# EAGLE design DCMotorControl.v01 (EAGLE 7.4.0)
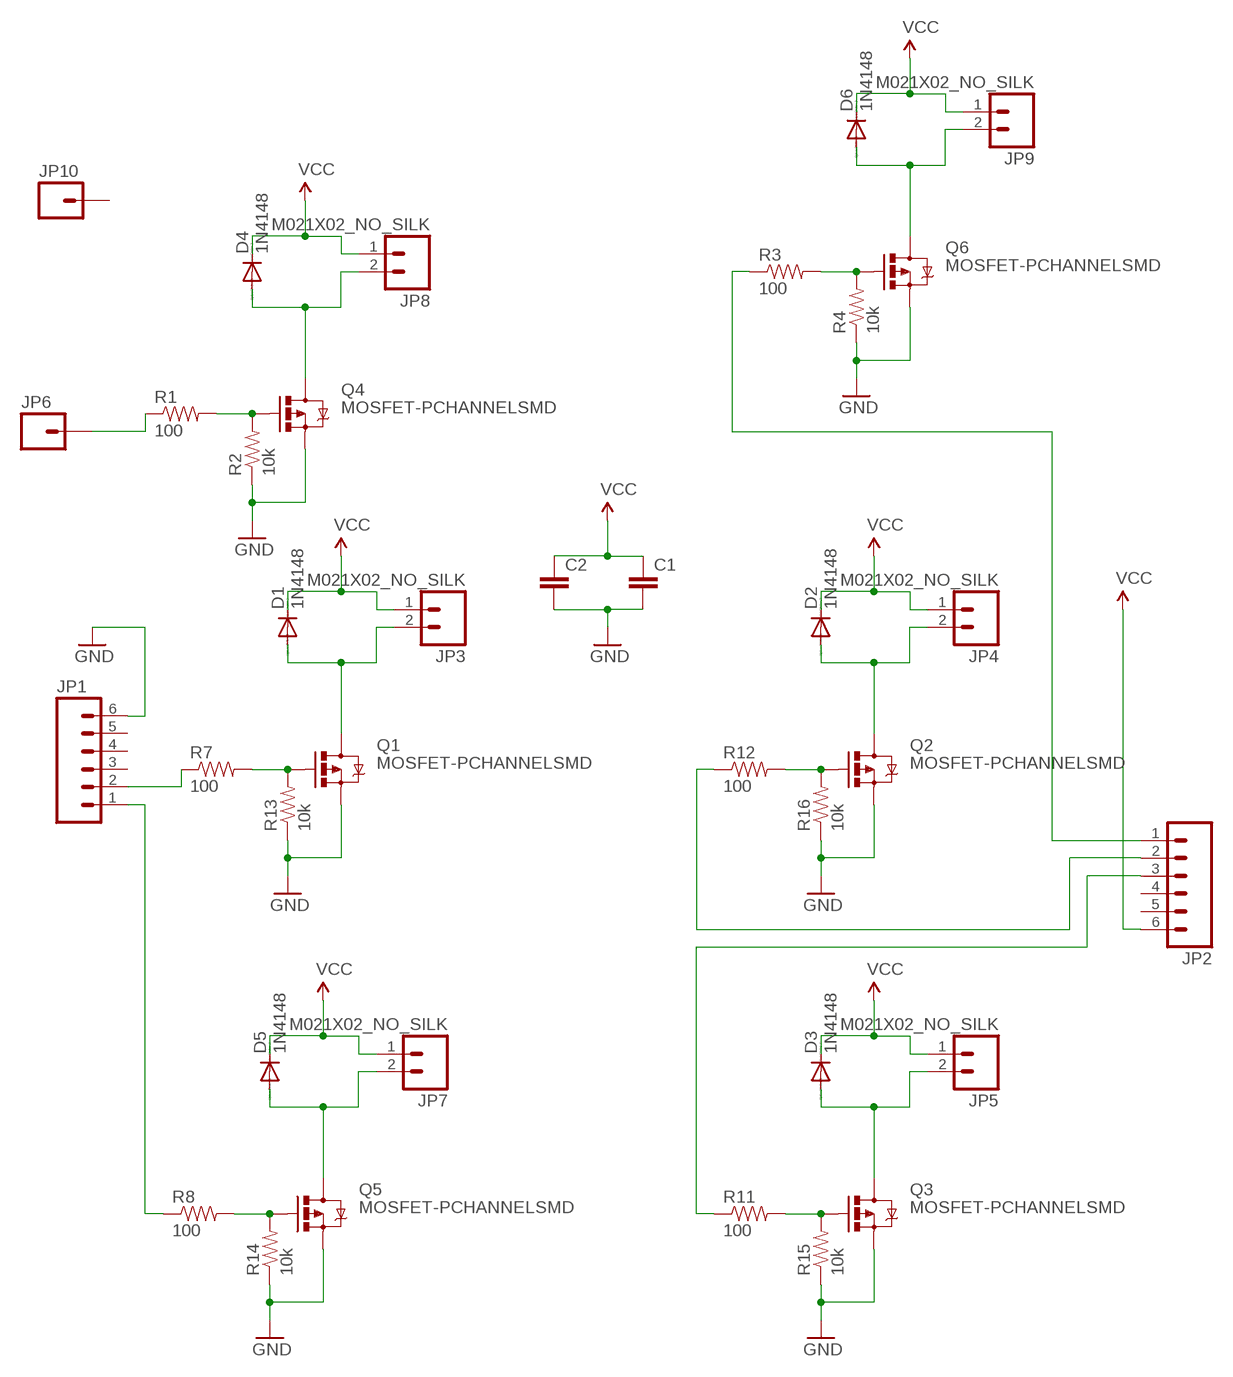
[diagram p0: schematic, sheet 1]

## Parts
C1  CAP0805  [0805]
C2  CAP0805  [0805]
D1  1N4148  DIODE-SOD323-R  [SOD323-R]
D2  1N4148  DIODE-SOD323-R  [SOD323-R]
D3  1N4148  DIODE-SOD323-R  [SOD323-R]
D4  1N4148  DIODE-SOD323-R  [SOD323-R]
D5  1N4148  DIODE-SOD323-R  [SOD323-R]
D6  1N4148  DIODE-SOD323-R  [SOD323-R]
JP1  M06NO_SILK  [1X06_NO_SILK]
JP2  M06NO_SILK  [1X06_NO_SILK]
JP3  M021X02_NO_SILK  [1X02_NO_SILK]
JP4  M021X02_NO_SILK  [1X02_NO_SILK]
JP5  M021X02_NO_SILK  [1X02_NO_SILK]
JP6  M01NOSILK-KIT  [1X01NS-KIT]
JP7  M021X02_NO_SILK  [1X02_NO_SILK]
JP8  M021X02_NO_SILK  [1X02_NO_SILK]
JP9  M021X02_NO_SILK  [1X02_NO_SILK]
JP10  M01NOSILK-KIT  [1X01NS-KIT]
Q1  MOSFET-PCHANNELSMD  [SOT23-3]
Q2  MOSFET-PCHANNELSMD  [SOT23-3]
Q3  MOSFET-PCHANNELSMD  [SOT23-3]
Q4  MOSFET-PCHANNELSMD  [SOT23-3]
Q5  MOSFET-PCHANNELSMD  [SOT23-3]
Q6  MOSFET-PCHANNELSMD  [SOT23-3]
R1  100  RESISTOR0603-RES  [0603-RES]
R2  10k  RESISTOR0603-RES  [0603-RES]
R3  100  RESISTOR0603-RES  [0603-RES]
R4  10k  RESISTOR0603-RES  [0603-RES]
R7  100  RESISTOR0603-RES  [0603-RES]
R8  100  RESISTOR0603-RES  [0603-RES]
R11  100  RESISTOR0603-RES  [0603-RES]
R12  100  RESISTOR0603-RES  [0603-RES]
R13  10k  RESISTOR0603-RES  [0603-RES]
R14  10k  RESISTOR0603-RES  [0603-RES]
R15  10k  RESISTOR0603-RES  [0603-RES]
R16  10k  RESISTOR0603-RES  [0603-RES]

## Nets
GND: C1.2 C2.2 JP1.6 Q1.2(S) Q2.2(S) Q3.2(S) Q4.2(S) Q5.2(S) Q6.2(S) R2.1 R4.1 R13.1 R14.1 R15.1 R16.1
N$1: D1.A JP3.2 Q1.3(D)
N$2: Q1.1(G) R7.2 R13.2
N$3: JP1.2 R7.1
N$4: D5.A JP7.2 Q5.3(D)
N$5: Q5.1(G) R8.2 R14.2
N$6: JP1.1 R8.1
N$7: D2.A JP4.2 Q2.3(D)
N$8: Q2.1(G) R12.2 R16.2
N$9: JP2.2 R12.1
N$10: D3.A JP5.2 Q3.3(D)
N$11: Q3.1(G) R11.2 R15.2
N$12: JP2.3 R11.1
N$13: D4.A JP8.2 Q4.3(D)
N$14: Q4.1(G) R1.2 R2.2
N$15: JP6.1 R1.1
N$16: D6.A JP9.2 Q6.3(D)
N$17: Q6.1(G) R3.2 R4.2
N$18: JP2.1 R3.1
VCC: C1.1 C2.1 D1.C D2.C D3.C D4.C D5.C D6.C JP2.6 JP3.1 JP4.1 JP5.1 JP7.1 JP8.1 JP9.1
Unconnected: JP1.3 JP1.4 JP1.5 JP2.4 JP2.5 JP10.1

## Library data of the parts
C1 C2 = SparkFun-Capacitors:CAP: Capacitor Standard 0603 ceramic capacitor, and 0.1" leaded capacitor.
D1-D6 = diode:DIODE-: DIODE
JP1 JP2 = SparkFun-Connectors:M06: Header 6 Standard 6-pin 0.1" header. Use with straight break away headers (SKU : PRT-00116), right angle break away headers (PRT-00553), swiss pins (PRT-00743), machine pins (PRT-00117), and female headers (PRT-00115). Molex polarized connector foot print use with SKU : PRT-08094 with associated crimp pins and housings. NOTES ON THE VARIANTS LOCK and LOCK_LONGPADS... This footprint was designed to help hold the alignment of a through-hole component (i.e. 6-pin header) while soldering it into place. You may notice that each hole has been shifted either up or down by 0.005 of an inch from it's more standard position (which is a perfectly straight line). This slight alteration caused the pins (the squares in the middle) to touch the edges of the holes. Because they are alternating, it causes a "brace" to hold the component in place. 0.005 has proven to be the perfect amount of "off-center" position when using our standard breakaway headers. Although looks a little odd when you look at the bare footprint, once you have a header in there, the alteration is very hard to notice. Also,if you push a header all the way into place, it is covered up entirely on the bottom side. This idea of altering the position of holes to aid alignment will be further integrated into the Sparkfun Library for other footprints. It can help hold any component with 3 or more connection pins.
JP3-JP5 JP7-JP9 = SparkFun-Connectors:M02: Standard 2-pin 0.1" header. Use with - straight break away headers ( PRT-00116) - right angle break away headers (PRT-00553) - swiss pins (PRT-00743) - machine pins (PRT-00117) - female headers (PRT-00115) Molex polarized connector foot print use with: PRT-08233 with associated crimp pins and housings. 2.54_SCREWTERM for use with PRT-10571. 3.5mm Screw Terminal footprints for PRT-08084 5mm Screw Terminal footprints for use with PRT-08433
JP6 JP10 = SparkFun-Connectors:M01: Header 1 Standard 1-pin 0.1" header. Use with straight break away headers (SKU : PRT-00116), right angle break away headers (PRT-00553), swiss pins (PRT-00743), machine pins (PRT-00117), and female headers (PRT-00115). SMTSO-256-ET is a "flush mount" nut for a 4-40 screw. The older package used to be too tight, and did not allow it to sit properly thru the drill hit. The latest (0.165DIA) fits nice and snug.
Q1-Q6 = SparkFun-DiscreteSemi:MOSFET-PCHANNEL: Generic PMOSFET IRLML2244 - TRANS-11153 (SOT-23 -20V -4.3A) (1.Gate 2.Source 3.Drain) FQP27P06 - COM-10349 <http://www.sparkfun.com/products/10349> (TO-220 -60V -27A) (1.Gate 2.Source 3.Drain)
R1-R4 R7 R8 R11-R16 = SparkFun-Passives:RESISTOR: Resistor Basic schematic elements and footprints for 0603, 1206, and PTH resistors.

## Board
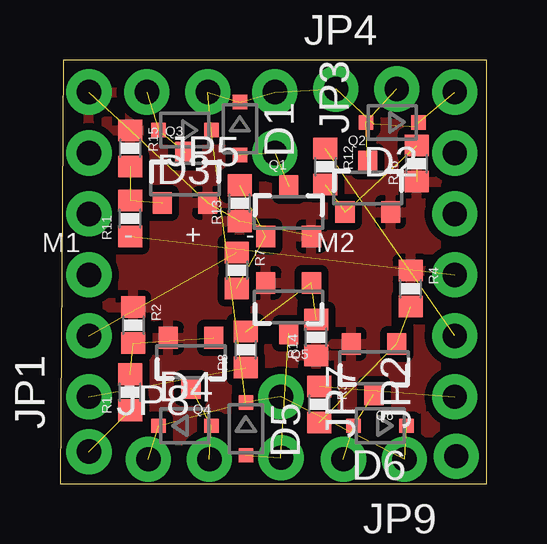
[diagram p1: board, top side]
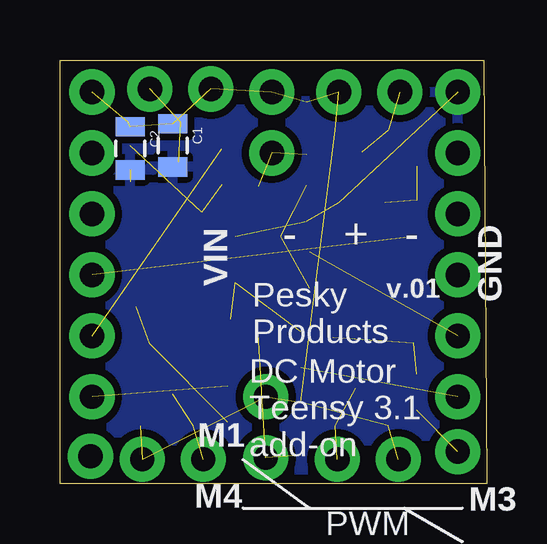
[diagram p2: board, bottom side, seen from below]

Size 17.78 x 17.65 mm. Coordinates in mm from the lower left corner, seen from the top.
Outline: 0,0 17.78,0 17.78,17.65 0.13,17.65 0,0
Copper layers (1*16): Top 0.0356mm / dielectric 1.5011mm / Bottom 0.0356mm
Design rules "OSHPark *": minimum track width 6mil, minimum drill 13mil, track to track 6mil, track to pad 6mil, pad to pad 6mil, via to via 6mil, smd to smd 6mil, copper to edge 15mil, drill to drill 6mil, minimum pad ring 7mil, minimum via ring 7mil, stop-mask expansion 3mil, vias tented up to drill 20mil, thermal gap 10mil

### Footprints (pad centres in the part's own frame; a part is rotated, then mirrored left to right if it is on the bottom)
0805 = smd 0.8 x 1.2: 1 -0.9,0; 2 0.9,0
SOD323-R = smd 0.6 x 0.6: A 1.1,0; C -1.1,0
1X06_NO_SILK = drill 1.016 pad 1.88: 1 0,0; 2 2.54,0; 3 5.08,0; 4 7.62,0; 5 10.16,0; 6 12.7,0
1X02_NO_SILK = drill 1.016 pad 1.88: 1 0,0; 2 2.54,0
1X01NS-KIT = drill 1.016 pad 1.88: 1 0,0
SOT23-3 = smd 0.8 x 0.9: 1 -0.95,-1; 2 0.95,-1; 3 0,1.1
0603-RES = smd 0.9 x 1: 1 -0.75,0; 2 0.75,0

### Placement (x,y rotation side)
C1  13.08,14.1 270 bottom
C2  14.86,13.97 270 bottom
D1  7.49,14.8 270 top
D2  13.84,15.05 180 top
D3  5.21,14.73 180 top
D4  5.21,2.41 0 top
D5  7.75,2.29 270 top
D6  13.34,2.41 180 top
JP1  1.21,3.62 90 top
JP2  16.45,3.62 90 top
JP3  8.95,16.32 270 top
JP4  11.49,16.45 0 top
JP5  6.16,16.32 180 top
JP6  1.21,1.33 0 top
JP7  9.21,3.62 270 top
JP8  3.68,1.02 0 top
JP9  14.35,1.02 180 top
JP10  16.51,1.14 0 top
Q1  9.53,11.3 0 top
Q2  12.83,12.32 0 top
Q3  5.21,12.7 0 top
Q4  5.46,5.08 180 top
Q5  9.53,7.37 180 top
Q6  13.08,4.83 180 top
R1  2.92,3.81 90 top
R2  3.05,6.6 270 top
R3  10.79,3.3 270 top
R4  14.61,8.13 270 top
R7  7.37,8.89 270 top
R8  7.75,5.59 90 top
R11  2.92,11.05 90 top
R12  11.05,13.21 270 top
R13  7.49,11.68 90 top
R14  10.67,6.1 90 top
R15  2.92,13.97 270 top
R16  14.86,13.34 90 top

### Tracks (layer width: path | path; a pad name or v marks a point on that pad's centre or on a via)
GND  (5 unrouted)
  pour Top (isolate 0.305): -0.25,17.53 -0.13,-0.64 17.78,-0.38 17.78,17.65
  pour Bottom (isolate 0.305): 0.38,17.65 0.25,-0.38 17.78,-0.25 17.78,17.65
N$1  (2 unrouted)
N$2  (2 unrouted)
N$3  (1 unrouted)
N$4  (2 unrouted)
N$5  (2 unrouted)
N$6  (1 unrouted)
N$7  (2 unrouted)
N$8  (2 unrouted)
N$9  (1 unrouted)
N$10  (2 unrouted)
N$11  (2 unrouted)
N$12  (1 unrouted)
N$13  (2 unrouted)
N$14  (2 unrouted)
N$15  (1 unrouted)
N$16  (2 unrouted)
N$17  (2 unrouted)
N$18  (1 unrouted)
VCC  (14 unrouted)

### Text on the board
tPlace: - | + | - | M1 | M2 | M3 | - | + | - | M4
bPlace: GND | VIN | - | + | - | v.01 | Pesky / Products | DC Motor / Teensy 3.1 / add-on | M1 | M3 | M4 | PWM | M2 | - | - | +